# EAGLE schematic L298BOB (EAGLE 6.1)
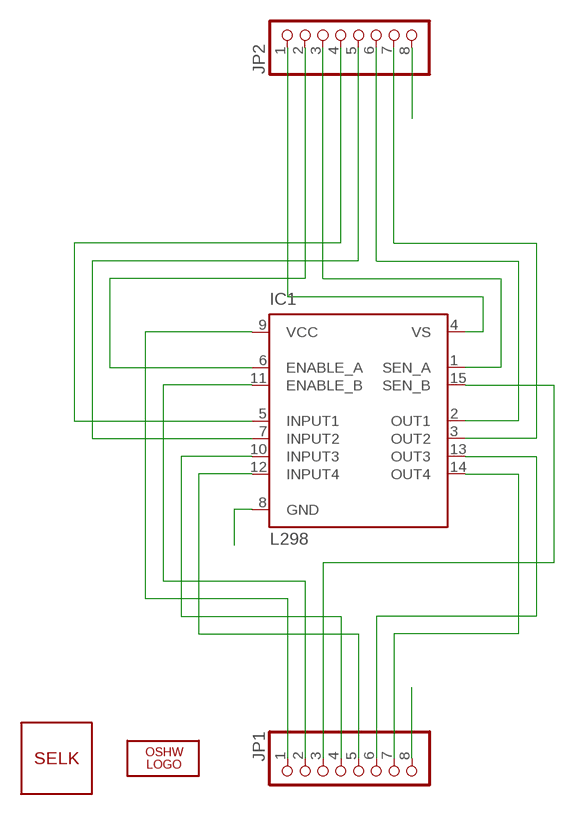
[diagram p0: schematic, sheet 1]

## Parts
IC1  L298  [MULTIWATT-15]
JP1  PINHD-1X8  [1X08]
JP2  PINHD-1X8  [1X08]
LOGO1  OSHW_LOGO_FILLX0200-NT  [OSHW_FILLX200_NOTEXT]
U$1  SELK02  [SELK02]

## Nets
GND: IC1.8(GND) JP1.8 JP2.8
N$1: IC1.4(VS) JP2.1
N$2: IC1.1(SEN_A) JP2.3
N$3: IC1.5(INPUT1) JP2.4
N$4: IC1.7(INPUT2) JP2.5
N$5: IC1.2(OUT1) JP2.6
N$6: IC1.3(OUT2) JP2.7
N$7: IC1.9(VCC) JP1.1
N$8: IC1.6(ENABLE_A) JP2.2
N$9: IC1.11(ENABLE_B) JP1.2
N$10: IC1.15(SEN_B) JP1.3
N$11: IC1.10(INPUT3) JP1.4
N$12: IC1.12(INPUT4) JP1.5
N$13: IC1.13(OUT3) JP1.6
N$14: IC1.14(OUT4) JP1.7

## Library data of the parts
IC1 = st-microelectronics:L298: DUAL FULL-BRIDGE DRIVER; MPN: L298N; OC_FARNELL: 1589425; OC_NEWARK: 32M1527
JP1 JP2 = pinhead:PINHD-1X8: PIN HEADER
LOGO1 = ohw-logo:OSHW_LOGO_FILL
U$1 = selk:SELK02